# EAGLE design SmartController (EAGLE 9.2.2)
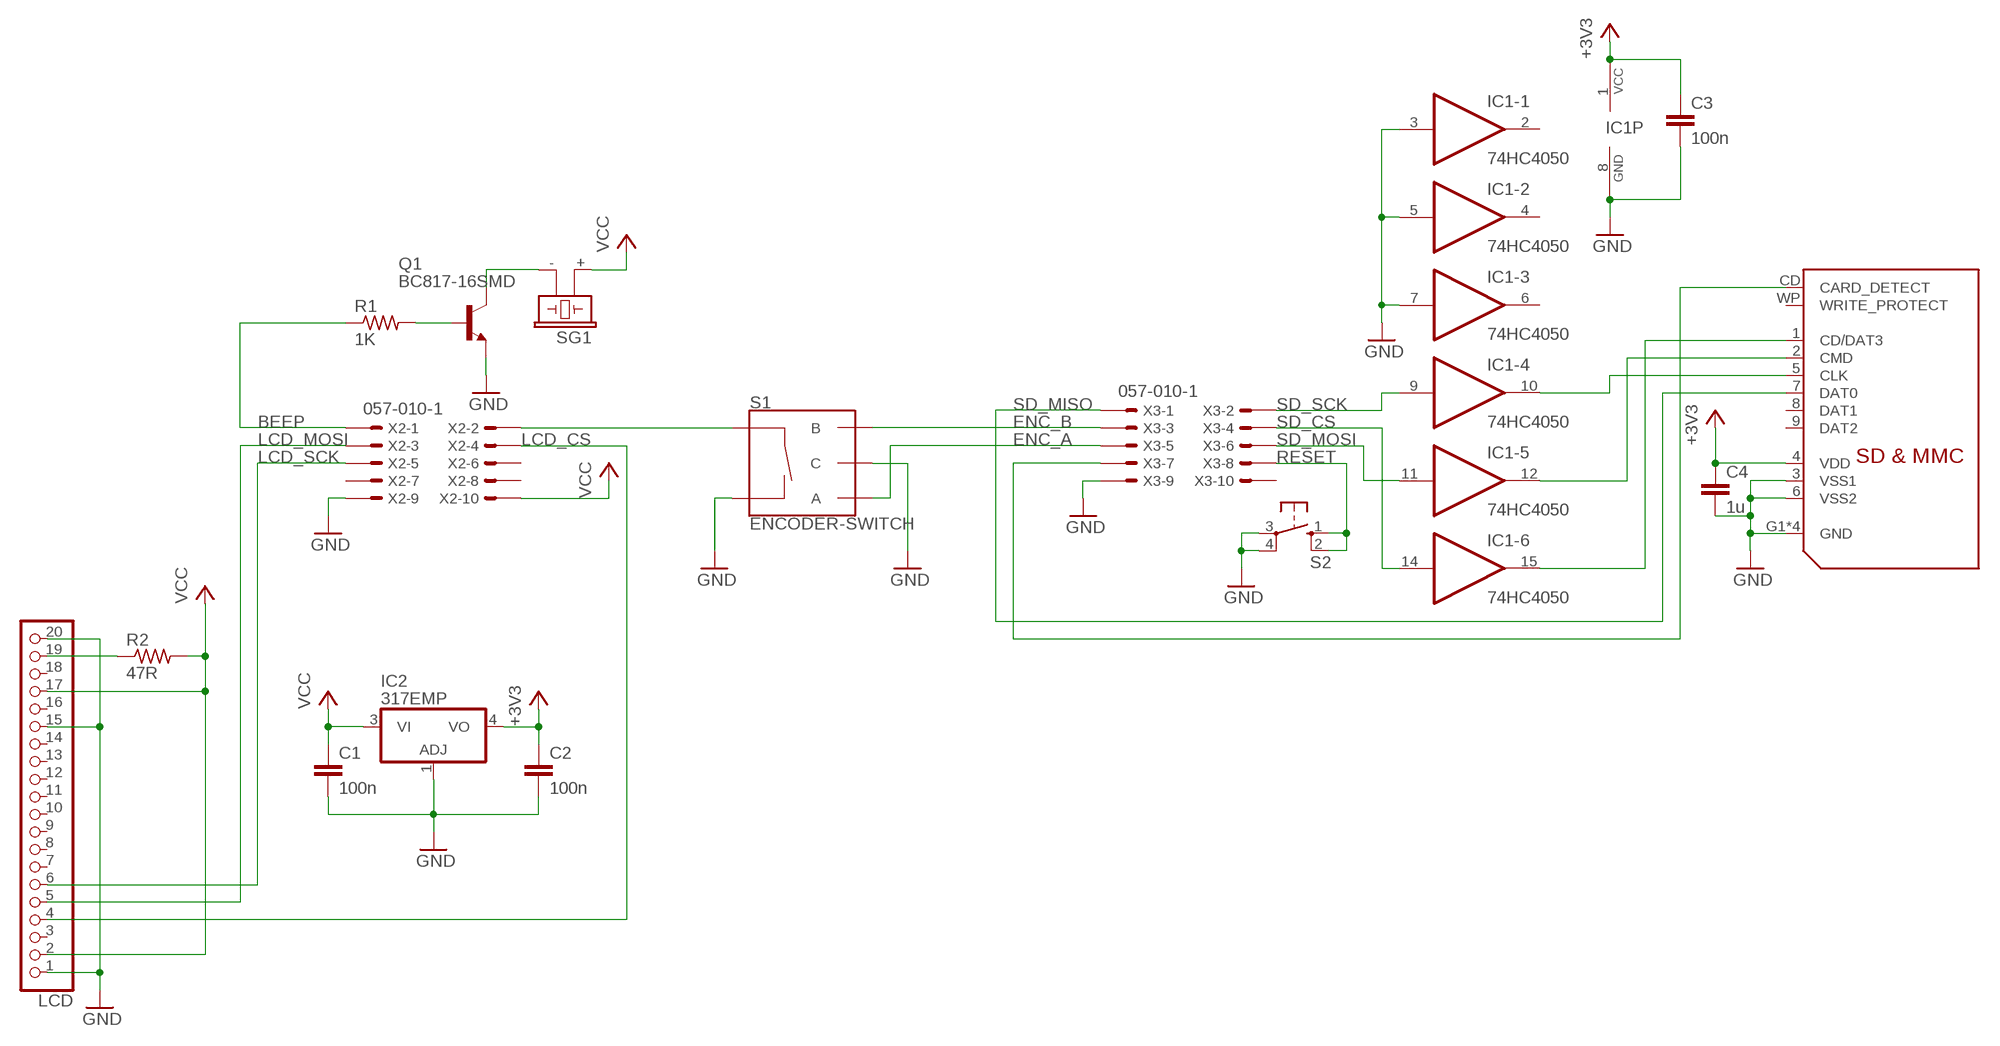
[diagram p0: schematic, sheet 1]

## Parts
C1  100n  C-EUC0805  [C0805]
C2  100n  C-EUC0805  [C0805]
C3  100n  C-EUC0805  [C0805]
C4  1u  C-EUC0805  [C0805]
IC1  74HC4050  [SO16]
IC2  317EMP  [SOT223]
LCD  PINHD-1X20  [1X20]
Q1  BC817-16SMD  [SOT23-BEC]
R1  1K  R-US_R0805  [R0805]
R2  47R  R-US_R0805  [R0805]
S1  ENCODER-SWITCH  [ROTARY_ENC_PLAIN]
S2  10-XX  [B3F-10XX]
SG1  F/CM12P  [F/CM12P]
X1  TE-2041021  [2041021]
X2  057-010-1  [057-010-1]
X3  057-010-1  [057-010-1]

## Nets
+3V3: C2.1 C3.1 C4.1 IC1.1(P:VCC) IC2.4(VO) X1.4(VDD)
BEEP: R1.1 X2.1
ENC_A: S1.A X3.5
ENC_B: S1.B X3.3
GND: C1.2 C2.2 C3.2 C4.2 IC1.3(-1:I) IC1.5(-2:I) IC1.7(-3:I) IC1.8(P:GND) IC2.1(ADJ) LCD.1 LCD.15 LCD.20 Q1.E S1.C S1.SW- S2.3(P) S2.4(P1) X1.3(VSS1) X1.6(VSS2) X1.G1(GND) X1.G2(GND) X1.G3(GND) X1.G4(GND) X2.9 X3.9
LCD_CS: LCD.4 X2.4
LCD_MOSI: LCD.5 X2.3
LCD_SCK: LCD.6 X2.5
N$1: X1.CD(CARD_DETECT) X3.7
N$2: S1.SW+ X2.2
N$3: LCD.19 R2.1
N$4: IC1.15(-6:O) X1.1(CD/DAT3)
N$5: IC1.12(-5:O) X1.2(CMD)
N$6: IC1.10(-4:O) X1.5(CLK)
N$7: Q1.B R1.2
N$8: Q1.C SG1.-
RESET: S2.1(S) S2.2(S1) X3.8
SD_CS: IC1.14(-6:I) X3.4
SD_MISO: X1.7(DAT0) X3.1
SD_MOSI: IC1.11(-5:I) X3.6
SD_SCK: IC1.9(-4:I) X3.2
VCC: C1.1 IC2.3(VI) LCD.2 LCD.17 R2.2 SG1.+ X2.10
Unconnected: IC1.2(-1:O) IC1.4(-2:O) IC1.6(-3:O) LCD.3 LCD.7 LCD.8 LCD.9 LCD.10 LCD.11 LCD.12 LCD.13 LCD.14 LCD.16 LCD.18 X1.8(DAT1) X1.9(DAT2) X1.WP(WRITE_PROTECT) X2.6 X2.7 X2.8 X3.10

## Library data of the parts
C1-C4 = resistor:C-EU: CAPACITOR, European symbol
IC1 = misc:74HC4050
IC2 = linear:*317: Positive VOLTAGE REGULATOR
LCD = pinhead:PINHD-1X20: PIN HEADER
Q1 = transistor-npn:BC817*: NPN Transistor
R1 R2 = resistor:R-US_: RESISTOR, American symbol
S1 = SparkFun-Switches:ENCODER-SWITCH: Rotary Encoder w/ Select Switch Encoders rotate similarly to potentiometers, but they’re different from potentiometers in that an encoder has full rotation without limits. They output gray code so that you can tell how much and in which direction the encoder has been turned. This encoder includes a push-down select switch built into the shaft. SparkFun Products Rotary Encoder <https://www.sparkfun.com/products/9117> (COM-09117); SF_SKU: COM-09117
S2 = switch-omron:10-XX: OMRON SWITCH; MPN: B3F-1000; OC_FARNELL: 176432; OC_NEWARK: 36M3542
SG1 = buzzer:F/CM12P: BUZZER Source: Buerklin; OC_FARNELL: unknown; OC_NEWARK: unknown
X1 = misc:TE-2041021
X2 X3 = con-panduit:057-010-: CONNECTOR 10-pin series 057 contact pc board low profile headers; OC_FARNELL: unknown; OC_NEWARK: unknown

## Board
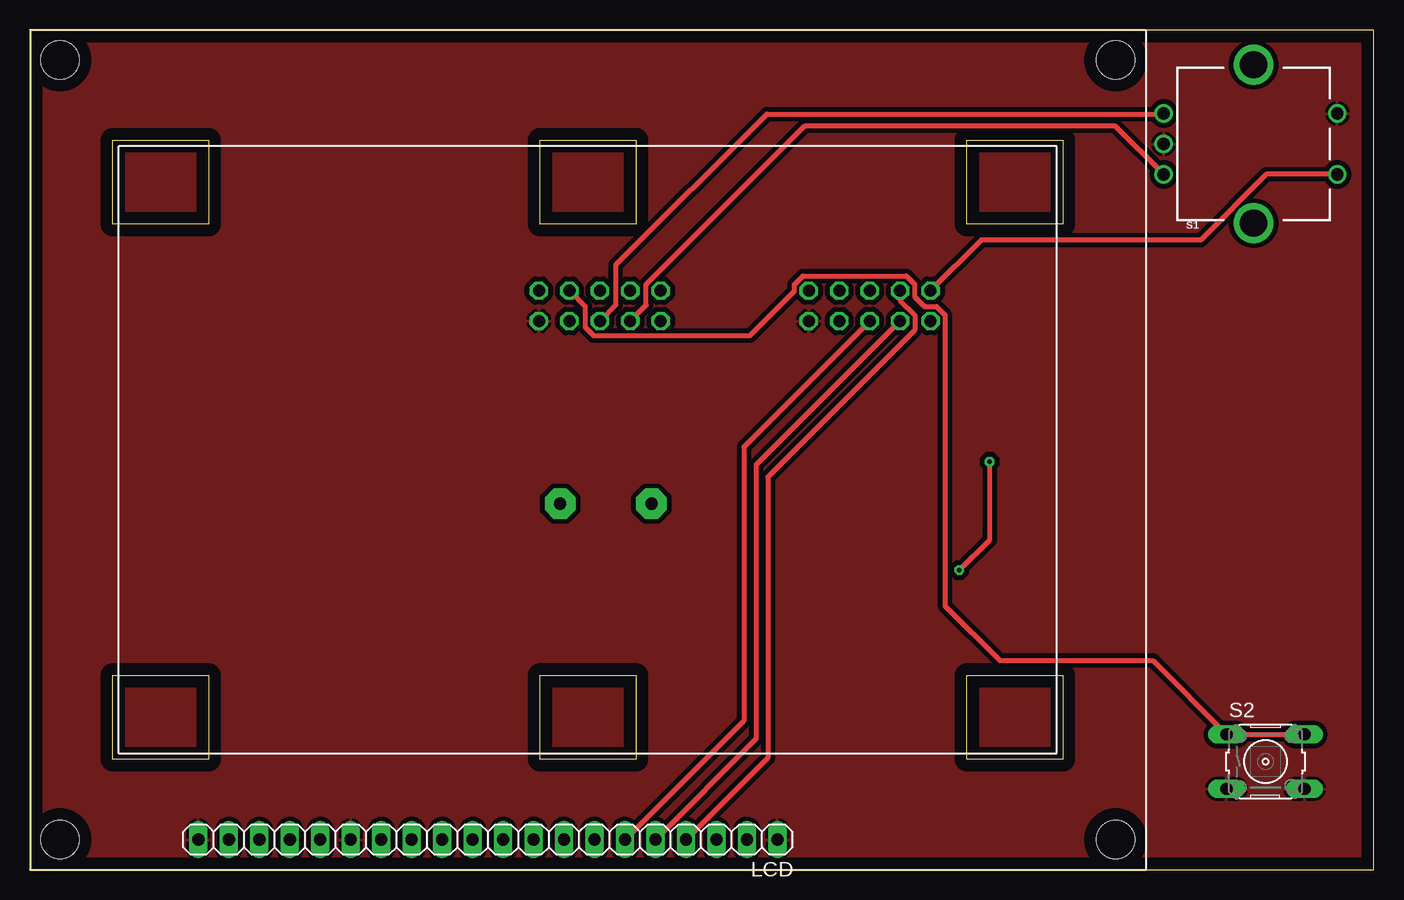
[diagram p1: board, top side]
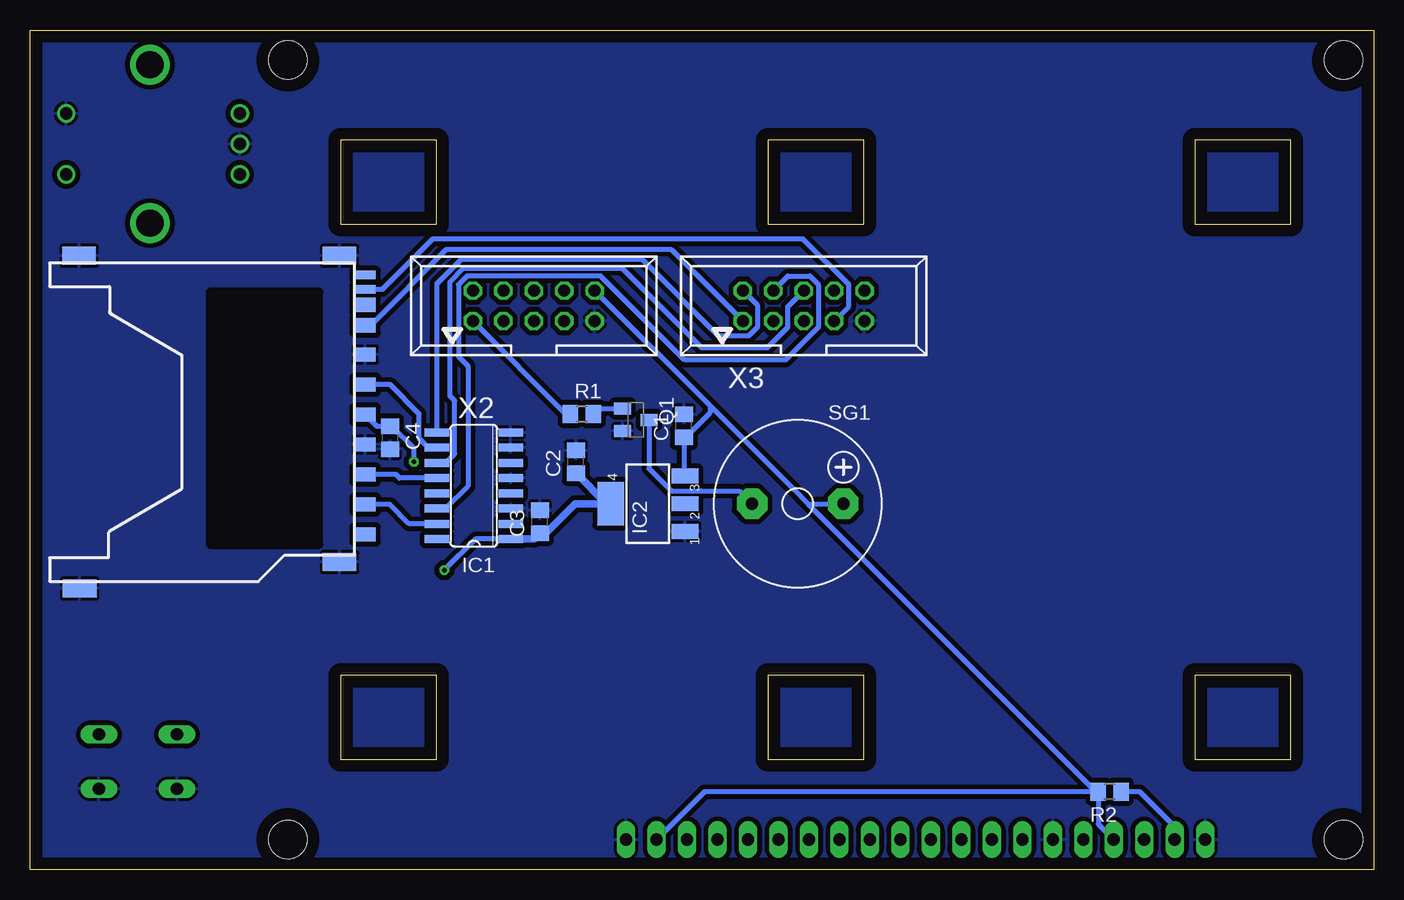
[diagram p2: board, bottom side, seen from below]

Size 112 x 70 mm. Coordinates in mm from the lower left corner, seen from the top.
Outline: 0,0 112,0 112,70 0,70 0,0
Outline: 6.9,60.8 14.9,60.8 14.9,53.8 6.9,53.8 6.9,60.8
Outline: 78.1,60.8 86.1,60.8 86.1,53.8 78.1,53.8 78.1,60.8
Outline: 6.9,16.2 14.9,16.2 14.9,9.2 6.9,9.2 6.9,16.2
Outline: 78.1,16.2 86.1,16.2 86.1,9.2 78.1,9.2 78.1,16.2
Outline: 42.5,16.2 50.5,16.2 50.5,9.2 42.5,9.2 42.5,16.2
Outline: 42.5,60.8 50.5,60.8 50.5,53.8 42.5,53.8 42.5,60.8
Copper layers (1*16): Top 0.035mm / dielectric 1.5mm / Bottom 0.035mm
Design rules "default *": minimum track width 6mil, minimum drill 0.35mm, track to track 10mil, track to pad 10mil, pad to pad 10mil, via to via 10mil, smd to smd 6mil, copper to edge 40mil, drill to drill 6mil, minimum pad ring 10mil, minimum via ring 8mil, stop-mask expansion 4mil, vias tented up to drill 0mil, thermal gap 10mil
Holes 3.2 mm at 2.5,2.5 90.5,2.5 2.5,67.5 90.5,67.5
tKeepout: area -0.5,-0.5 to 5.5,5.5; area -0.5,64.5 to 5.5,70.5; area 87.5,64.5 to 93.5,70.5; area 87.5,-0.5 to 93.5,5.5

### Footprints (pad centres in the part's own frame; a part is rotated, then mirrored left to right if it is on the bottom)
C0805 = smd 1.3 x 1.5: 1 -0.95,0; 2 0.95,0
SO16 = smd 0.66 x 2.032: 1 -4.445,-3.073; 2 -3.175,-3.073; 3 -1.905,-3.073; 4 -0.635,-3.073; 5 0.635,-3.073; 6 1.905,-3.073; 7 3.175,-3.073; 8 4.445,-3.073; 9 4.445,3.073; 10 3.175,3.073; 11 1.905,3.073; 12 0.635,3.073; 13 -0.635,3.073; 14 -1.905,3.073; 15 -3.175,3.073; 16 -4.445,3.073
SOT223 = smd 1.219 x 2.235: 1 -2.311,-3.099; 2 0,-3.099; 3 2.311,-3.099 | smd 3.6 x 2.2: 4 0,3.099
1X20 = drill 1.016 long: 1 -24.13,0; 2 -21.59,0; 3 -19.05,0; 4 -16.51,0; 5 -13.97,0; 6 -11.43,0; 7 -8.89,0; 8 -6.35,0; 9 -3.81,0; 10 -1.27,0; 11 1.27,0; 12 3.81,0; 13 6.35,0; 14 8.89,0; 15 11.43,0; 16 13.97,0; 17 16.51,0; 18 19.05,0; 19 21.59,0; 20 24.13,0
SOT23-BEC = smd 1 x 1.4: B -0.95,-1.1; C 0,1.1; E 0.95,-1.1
R0805 = smd 1.3 x 1.5: 1 -0.95,0; 2 0.95,0
ROTARY_ENC_PLAIN = drill 1.016: A 7.493,-2.54; B 7.493,2.54; C 7.493,0; SW+ -6.985,2.54; SW- -6.985,-2.54 | drill 2.286: P$3 0,6.604; P$4 0,-6.604
B3F-10XX = drill 1.016 long: 1 -3.251,2.261; 2 3.251,2.261; 3 -3.251,-2.261; 4 3.251,-2.261
F/CM12P = drill 1.016 pad 2.54 octagon: + 3.81,0; - -3.81,0
2041021 = smd 1.2 x 1.8: 1 7,2.8; 2 4.5,2.8; 3 2,2.8; 4 -0.5,2.8; 5 -3,2.8; 6 -5.5,2.8; 7 -7.93,2.8; 8 -9.63,2.8; 9 9.5,2.8 | smd 0.7 x 1.8: CD -10.93,2.8; WP -12.13,2.8 | smd 1.5 x 2.8: G1 11.809,0.666; G2 14.009,-20.984; G3 -13.741,-21.034; G4 -13.741,0.666
057-010-1 = drill 1 octagon: 1 -5.08,-1.27; 2 -5.08,1.27; 3 -2.54,-1.27; 4 -2.54,1.27; 5 0,-1.27; 6 0,1.27; 7 2.54,-1.27; 8 2.54,1.27; 9 5.08,-1.27; 10 5.08,1.27

### Placement (x,y rotation side)
C1  57.5,37 90 bottom
C2  66.5,34 90 bottom
C3  69.5,29 90 bottom
C4  82,36 270 bottom
IC1  75,32 90 bottom
IC2  60.5,30.5 90 bottom
LCD  38.17,2.5 180 top
Q1  61.5,37.5 270 bottom
R1  66,38 0 bottom
R2  22,6.5 180 bottom
S1  102,60.5 180 top
S2  103,9 0 top
SG1  48,30.5 0 bottom
X1  86.87,37.44 270 bottom
X2  70,47 0 bottom
X3  47.5,47 0 bottom

### Tracks (layer width: path | path; a pad name or v marks a point on that pad's centre or on a via)
+3V3  (via drill 0.4)
  Top 0.406: v77.46,24.96 80,27.5 v80,34
  Bottom 0.406: IC1.1 74.86,27.55 v77.46,24.96 | v80,34 80,35.1 81.85,36.95 C4.1 83.08,36.95 X1.4
  Bottom 0.61: C2.1 63.95,30.5 IC2.4 66.55,30.5 69,28.05 C3.1 70,27.55 IC1.1 72,27.55
BEEP
  Bottom 0.406: R1.1 67.35,38 X2.1
ENC_A
  Top 0.406: S1.A 94.47,63 61.42,63 48.83,50.41 48.83,47.06 X3.5
ENC_B
  Top 0.406: S1.B 90.45,62.02 64.62,62.02 51.37,48.77 51.37,47.06 X3.3
GND
  pour Bottom (isolate 0.406): 111.5,69.5 111.5,0.5 0.5,0.5 0.5,69.5
  pour Top (isolate 0.406): 112,70 112,0 0,0 0,70
LCD_CS
  Top 0.406: X2.4 72.54,47.44 73.75,46.23 73.75,45 61.5,32.75 61.5,9.32 LCD.4
LCD_MOSI
  Top 0.406: X2.3 60.54,33.73 60.54,10.9 LCD.5
LCD_SCK
  Top 0.406: X2.5 59.5,35.23 59.5,12.4 LCD.6
N$1
  Bottom 0.406: X3.7 43.75,46.94 43.75,48.77 47.56,52.58 78.42,52.58 82.63,48.37 X1.CD
N$2
  Top 0.406: X2.2 79.31,52.5 97.62,52.5 103.08,57.96 S1.SW+
N$3
  Bottom 0.406: LCD.19 16.58,3.58 19.5,6.5 R2.1
N$4
  Bottom 0.406: X1.1 82,30.44 80.39,28.82 IC1.15
N$5
  Bottom 0.406: X1.2 81.5,32.94 81.19,32.63 IC1.12
N$6
  Bottom 0.406: X1.5 82,40.44 79.55,37.99 79.55,35.92 78.8,35.17 IC1.10
N$7
  Bottom 0.406: R1.2 64.6,38.45 Q1.B
N$8
  Bottom 0.406: Q1.C 60.4,33.44 58.53,31.57 56.09,31.57 56.08,31.55 52.86,31.55 SG1.-
RESET
  Top 0.406: S2.2 S2.1 93.59,17.42 80.84,17.42 76.29,21.97 76.29,46.23 75.58,46.94 74.56,46.94 73.75,47.75 73.75,48.77 73.04,49.48 64.42,49.48 63.71,48.77 63.71,48.21 60.02,44.52 47,44.52 46.29,45.23 46.29,46.94 X3.8
SD_CS
  Bottom 0.406: X3.4 48.83,49.48 47,49.48 46.29,48.77 46.29,45.23 49.02,42.5 57.44,42.5 64.42,49.48 75.58,49.48 76.29,48.77 76.29,42.79 75.5,42 75.5,31.95 77.35,30.09 IC1.14
SD_MISO
  Bottom 0.406: X3.1 58.57,51.72 77.27,51.72 83.62,45.37 X1.7
SD_MOSI
  Bottom 0.406: X3.6 48.83,46.94 48.83,45.23 50.54,43.52 56.02,43.52 62.64,50.14 75.86,50.14 77,49 77,39.5 76.6,39.1 76.6,34.66 77.35,33.91 IC1.11
SD_SCK
  Bottom 0.406: X3.2 51.37,47.06 51.37,45.23 52.1,44.5 54.59,44.5 61.05,50.96 61.1,50.9 76.03,50.9 78.07,48.86 IC1.9
VCC
  Bottom 0.406: C1.1 57.5,35.9 | 57.5,35.9 57.5,32.91 IC2.3 | X2.10 55.33,38.67 | R2.2 24.15,6.5 | R2.2 23.15,6.5 | 23.15,6.5 55.76,6.5 LCD.2 | 57.5,35.9 55.33,38.08 55.33,38.67 | 55.33,38.67 48.33,31.68 47.15,30.5 | 47.15,30.5 23.15,6.5 | R2.2 22.95,3.79 LCD.17 | 47.15,30.5 SG1.+